# EAGLE schematic PowerSection (EAGLE 9.3.2)
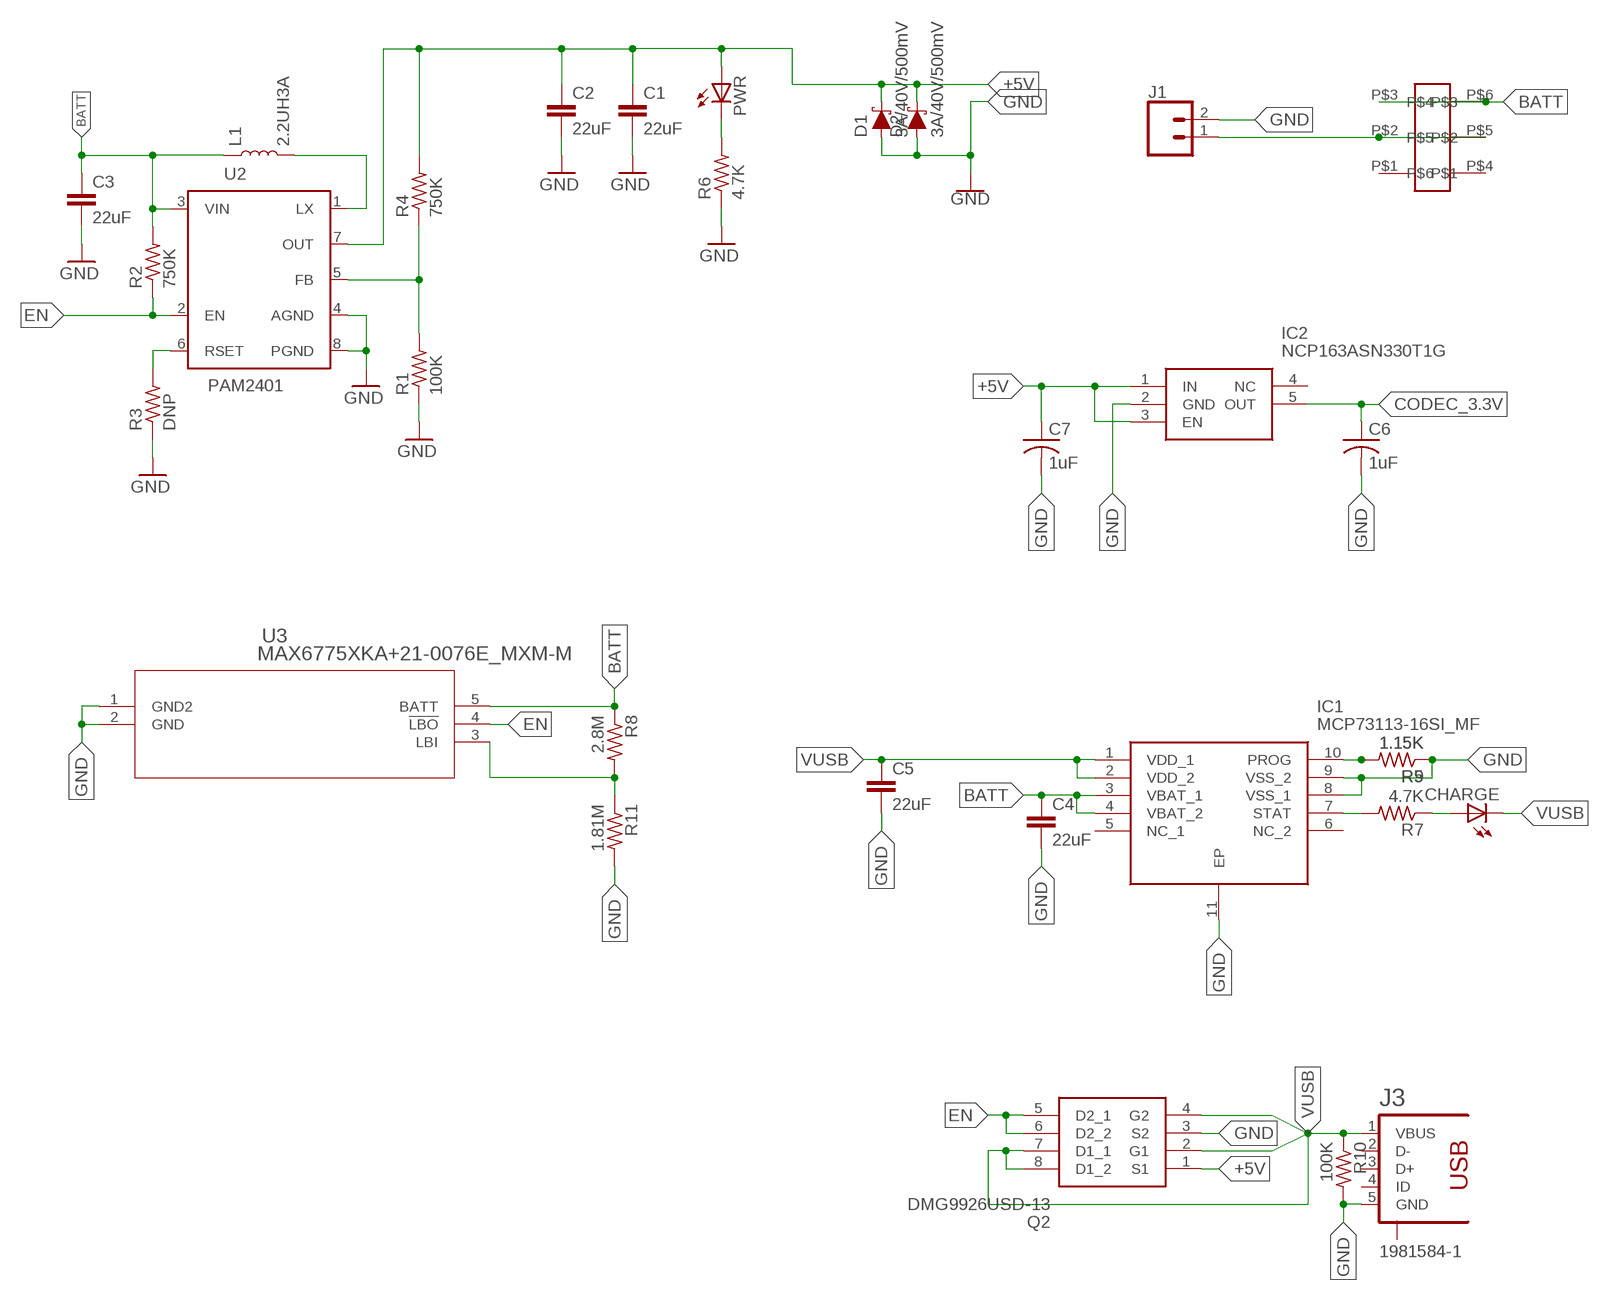
[diagram p0: schematic, sheet 1]

## Parts
C1  22uF  22UF-0805-6.3V-20%  [0805]
C2  22uF  22UF-0805-6.3V-20%  [0805]
C3  22uF  22UF-0805-6.3V-20%  [0805]
C4  22uF  22UF-0805-6.3V-20%  [0805]
C5  22uF  22UF-0805-6.3V-20%  [0805]
C6  1uF  C-USC1206  [C1206]
C7  1uF  C-USC1206  [C1206]
CHARGE  LEDCHIPLED_0805  [CHIPLED_0805]
D1  3A/40V/500mV  DIODE-SCHOTTKY-B340A  [SMA-DIODE]
D2  3A/40V/500mV  DIODE-SCHOTTKY-B340A  [SMA-DIODE]
IC1  MCP73113-16SI_MF  [SON50P300X300X100-11N]
IC2  NCP163ASN330T1G  [SOT95P280X145-5N]
J1  CONN_02  [1X02]
J3  1981584-1  [1981584-1]
L1  2.2UH3A  INDUCTOR-IFSC1515AHER2R2M01  [INDUCTOR_4X4MM]
PWR  LEDCHIPLED_0805  [CHIPLED_0805]
Q2  DMG9926USD-13  [SOIC127P600X175-8N]
R1  100K  R-US_M0805  [M0805]
R2  750K  R-US_M0805  [M0805]
R3  DNP  R-US_M0805  [M0805]
R4  750K  R-US_M0805  [M0805]
R5  1.15K  R-US_M0805  [M0805]
R6  4.7K  R-US_M0805  [M0805]
R7  4.7K  R-US_M0805  [M0805]
R8  2.8M  R-US_M0805  [M0805]
R9  1.15K  R-US_M0805  [M0805]
R10  100K  R-US_M0805  [M0805]
R11  1.81M  R-US_M0805  [M0805]
U2  PAM2401  [MSOP8]
U3  MAX6775XKA+21-0076E_MXM-M  [21-0076E_MXM-M]
U$1  JS202011JAQN  [JS202011JAQN]

## Nets
+5V: C1.1 C2.1 C7.1 D1.C D2.C IC2.1(IN) IC2.3(EN) PWR.A Q2.1(S1) R4.2 U2.7(OUT)
BATT: C3.1 C4.1 IC1.3(VBAT_1) IC1.4(VBAT_2) L1.P$1 R2.2 R8.1 U2.3(VIN) U3.5(BATT) U$1.P$3 U$1.P$6
CODEC_3.3V: C6.1 IC2.5(OUT)
EN: Q2.5(D2_1) Q2.6(D2_2) R2.1 U2.2(EN) U3.4(!LBO)
GND: C1.2 C2.2 C3.2 C4.2 C5.2 C6.2 C7.2 D1.A D2.A IC1.8(VSS_1) IC1.9(VSS_2) IC1.11(EP) IC2.2(GND) J1.2 J3.5(GND) Q2.3(S2) R1.1 R3.1 R5.1 R6.1 R9.1 R10.2 R11.2 U2.4(AGND) U2.8(PGND) U3.1(GND2) U3.2(GND)
LIPO+: J1.1 U$1.P$2 U$1.P$5
N$2: PWR.C R6.2
N$3: IC1.10(PROG) R5.2 R9.2
N$4: L1.P$2 U2.1(LX)
N$5: IC1.7(STAT) R7.2
N$6: R3.2 U2.6(RSET)
N$7: CHARGE.A R7.1
N$8: R8.2 R11.1 U3.3(LBI)
N$12: R1.2 R4.1 U2.5(FB)
VUSB: C5.1 CHARGE.C IC1.1(VDD_1) IC1.2(VDD_2) J3.1(VBUS) Q2.2(G1) Q2.4(G2) Q2.7(D1_1) Q2.8(D1_2) R10.1
Unconnected: IC1.5(NC_1) IC1.6(NC_2) IC2.4(NC) J3.2(D-) J3.3(D+) J3.4(ID) J3.S1 U$1.P$1 U$1.P$4

## Library data of the parts
C1-C5 = SparkFun-Capacitors:22UF: 22µF ceramic capacitors A capacitor is a passive two-terminal electrical component used to store electrical energy temporarily in an electric field.; PROD_ID: CAP-08402
C6 C7 = adafruit:C-US: CAPACITOR, American symbol
CHARGE PWR = adafruit:LED: LED OSRAM: - CHIPLED LG R971, LG N971, LY N971, LG Q971, LY Q971, LO R971, LY R971 LH N974, LH R974 LS Q976, LO Q976, LY Q976 LO Q996 - Hyper CHIPLED LW Q18S LB Q993, LB Q99A, LB R99A - SideLED LS A670, LO A670, LY A670, LG A670, LP A670 LB A673, LV A673, LT A673, LW A673 LH A674 LY A675 LS A676, LA A676, LO A676, LY A676, LW A676 LS A679, LY A679, LG A679 - Hyper Micro SIDELED® LS Y876, LA Y876, LO Y876, LY Y876 LT Y87S - SmartLED LW L88C, LW L88S LB L89C, LB L89S, LG L890 LS L89K, LO L89K, LY L89K LS L896, LA L896, LO L896, LY L896 - TOPLED LS T670, LO T670, LY T670, LG T670, LP T670 LSG T670, LSP T670, LSY T670, LOP T670, LYG T670 LG T671, LOG T671, LSG T671 LB T673, LV T673, LT T673, LW T673 LH T674 LS T676, LA T676, LO T676, LY T676, LB T676, LH T676, LSB T676, LW T676 LB T67C, LV T67C, LT T67C, LS T67K, LO T67K, LY T67K, LW E67C LS E67B, LA E67B, LO E67B, LY E67B, LB E67C, LV E67C, LT E67C LW T67C LS T679, LY T679, LG T679 LS T770, LO T770, LY T770, LG T770, LP T770 LB T773, LV T773, LT T773, LW T773 LH T774 LS E675, LA E675, LY E675, LS T675 LS T776, LA T776, LO T776, LY T776, LB T776 LHGB T686 LT T68C, LB T68C - Hyper Mini TOPLED® LB M676 - Mini TOPLED Santana® LG M470 LS M47K, LO M47K, LY M47K Source: http://www.osram.convergy.de/
D1 D2 = SparkFun-DiscreteSemi:DIODE-SCHOTTKY: Schottky diode A Schottky diode is a semiconductor diode which has a low forward voltage drop and a very fast switching action.; PROD_ID: DIO-09886
IC1 = SamacSys_Parts:MCP73113-16SI_MF: Single cell 6.5 OVP battery Charger Source: Datasheet <http://ww1.microchip.com/downloads/en/DeviceDoc/20002183E.pdf>; DESCRIPTION: Single cell 6.5 OVP battery Charger; HEIGHT: 1mm; MANUFACTURER_NAME: Microchip; MANUFACTURER_PART_NUMBER: MCP73113-16SI/MF; MOUSER_PART_NUMBER: 579-MCP73113-16SI/MF; MOUSER_PRICE-STOCK: https://www.mouser.co.uk/ProductDetail/Microchip-Technology/MCP73113-16SI-MF?qs=E6wAi2XWqcOPfjtQRKPDYw%3D%3D
IC2 = SamacSys_Parts:NCP163ASN330T1G: ON SEMICONDUCTOR - NCP163ASN330T1G - Fixed LDO Voltage Regulator, 2.2V to 5.5V, 105mV drop, 3.3V/250mA out, SOT-23-5 Source: Datasheet <https://componentsearchengine.com/Datasheets/2/NCP163ASN330T1G.pdf>; DESCRIPTION: ON SEMICONDUCTOR - NCP163ASN330T1G - Fixed LDO Voltage Regulator, 2.2V to 5.5V, 105mV drop, 3.3V/250mA out, SOT-23-5; HEIGHT: 1.45mm; MANUFACTURER_NAME: ON Semiconductor; MANUFACTURER_PART_NUMBER: NCP163ASN330T1G; MOUSER_PART_NUMBER: 863-NCP163ASN330T1G; MOUSER_PRICE-STOCK: https://www.mouser.co.uk/ProductDetail/ON-Semiconductor/NCP163ASN330T1G?qs=vLWxofP3U2ykJIQb1%252BPKcA%3D%3D
J1 = SparkFun-Connectors:CONN_02: Multi connection point. Often used as Generic Header-pin footprint for 0.1 inch spaced/style header connections On any of the 0.1 inch spaced packages, you can populate with these: Break Away Headers - Straight <https://www.sparkfun.com/products/116> (PRT-00116) Break Away Male Headers - Right Angle <https://www.sparkfun.com/products/553> (PRT-00553) Female Headers <https://www.sparkfun.com/products/115> (PRT-00115) Break Away Headers - Machine Pin <https://www.sparkfun.com/products/117> (PRT-00117) Break Away Female Headers - Swiss Machine Pin <https://www.sparkfun.com/products/743> (PRT-00743) For SCREWTERMINALS and SPRING TERMINALS visit here: Screw Terimnals on SparkFun.com <https://www.sparkfun.com/search/results?term=Screw+Terminals> (5mm/3.5mm/2.54mm spacing) This device is also useful as a general connection point to wire up your design to another part of your project. Our various solder wires solder well into these plated through hole pads. Hook-Up Wire - Assortment (Stranded, 22 AWG) <https://www.sparkfun.com/products/11375> (PRT-11375) Hook-Up Wire - Assortment (Solid Core, 22 AWG) <https://www.sparkfun.com/products/11367> (PRT-11367) View the entire wire category on our website here <https://www.sparkfun.com/categories/141> Special notes: Molex polarized connector foot print use with: PRT-08233 with associated crimp pins and housings. 2.54_SCREWTERM for use with PRT-10571. 3.5mm Screw Terminal footprints for PRT-08084 5mm Screw Terminal footprints for use with PRT-08432
J3 = audio amplifier example:1981584-1: Receptacle, micro-USB, type A/B Tyco Electronics
L1 = SparkFun-Coils:INDUCTOR: Inductors Resist changes in electrical current. Basically a coil of wire. SparkFun Products: SparkFun Load Cell Amplifier - HX711 <https://www.sparkfun.com/products/13879> IOIO-OTG - V2.2 <https://www.sparkfun.com/products/13613>; PROD_ID: NDUC-13770
Q2 = SamacSys_Parts:DMG9926USD-13: Diodes Inc DMG9926USD-13 Dual N-channel MOSFET Transistor, 8 A, 20 V, 8-Pin SOP Source: Datasheet; DESCRIPTION: Diodes Inc DMG9926USD-13 Dual N-channel MOSFET Transistor, 8 A, 20 V, 8-Pin SOP; HEIGHT: 1.75mm; MANUFACTURER_NAME: Diodes Inc.; MANUFACTURER_PART_NUMBER: DMG9926USD-13; MOUSER_PART_NUMBER: 621-DMG9926USD-13; MOUSER_PRICE-STOCK: https://www.mouser.co.uk/ProductDetail/Diodes-Incorporated/DMG9926USD-13?qs=4YT44p7w2buzSaF0raP1iw%3D%3D
R1-R11 = adafruit:R-US_: RESISTOR, American symbol
U2 = SparkFun-IC-Power:PAM2401: PAM2401 - Boost PMIC Specifications: Up to 1A output current 0.9V to 4.75V Input Range 2.5V to 5.0V Adjustable Output Voltage Datasheet <https://www.diodes.com/assets/Datasheets/PAM2401.pdf> (Diodes inc.); PROD_ID: IC-13769
U3 = BatteryStuff:MAX6775XKA+; BUILT_BY: EMA_UL_Team; MANUFACTURER_PART_NUMBER: MAX6775XKA+; SOURCELIBRARY: Maxim_2014-05-21; VENDOR: Maxim Integrated Products
U$1 = SMD Slide Switch:JS202011JAQN

## Net classes
0 default: width 0.152 mm, drill 0.305 mm, clearance 0.152 mm